# EAGLE design MySens-GWeasyRS485-Nano-V21-014 (EAGLE 7.6.0)
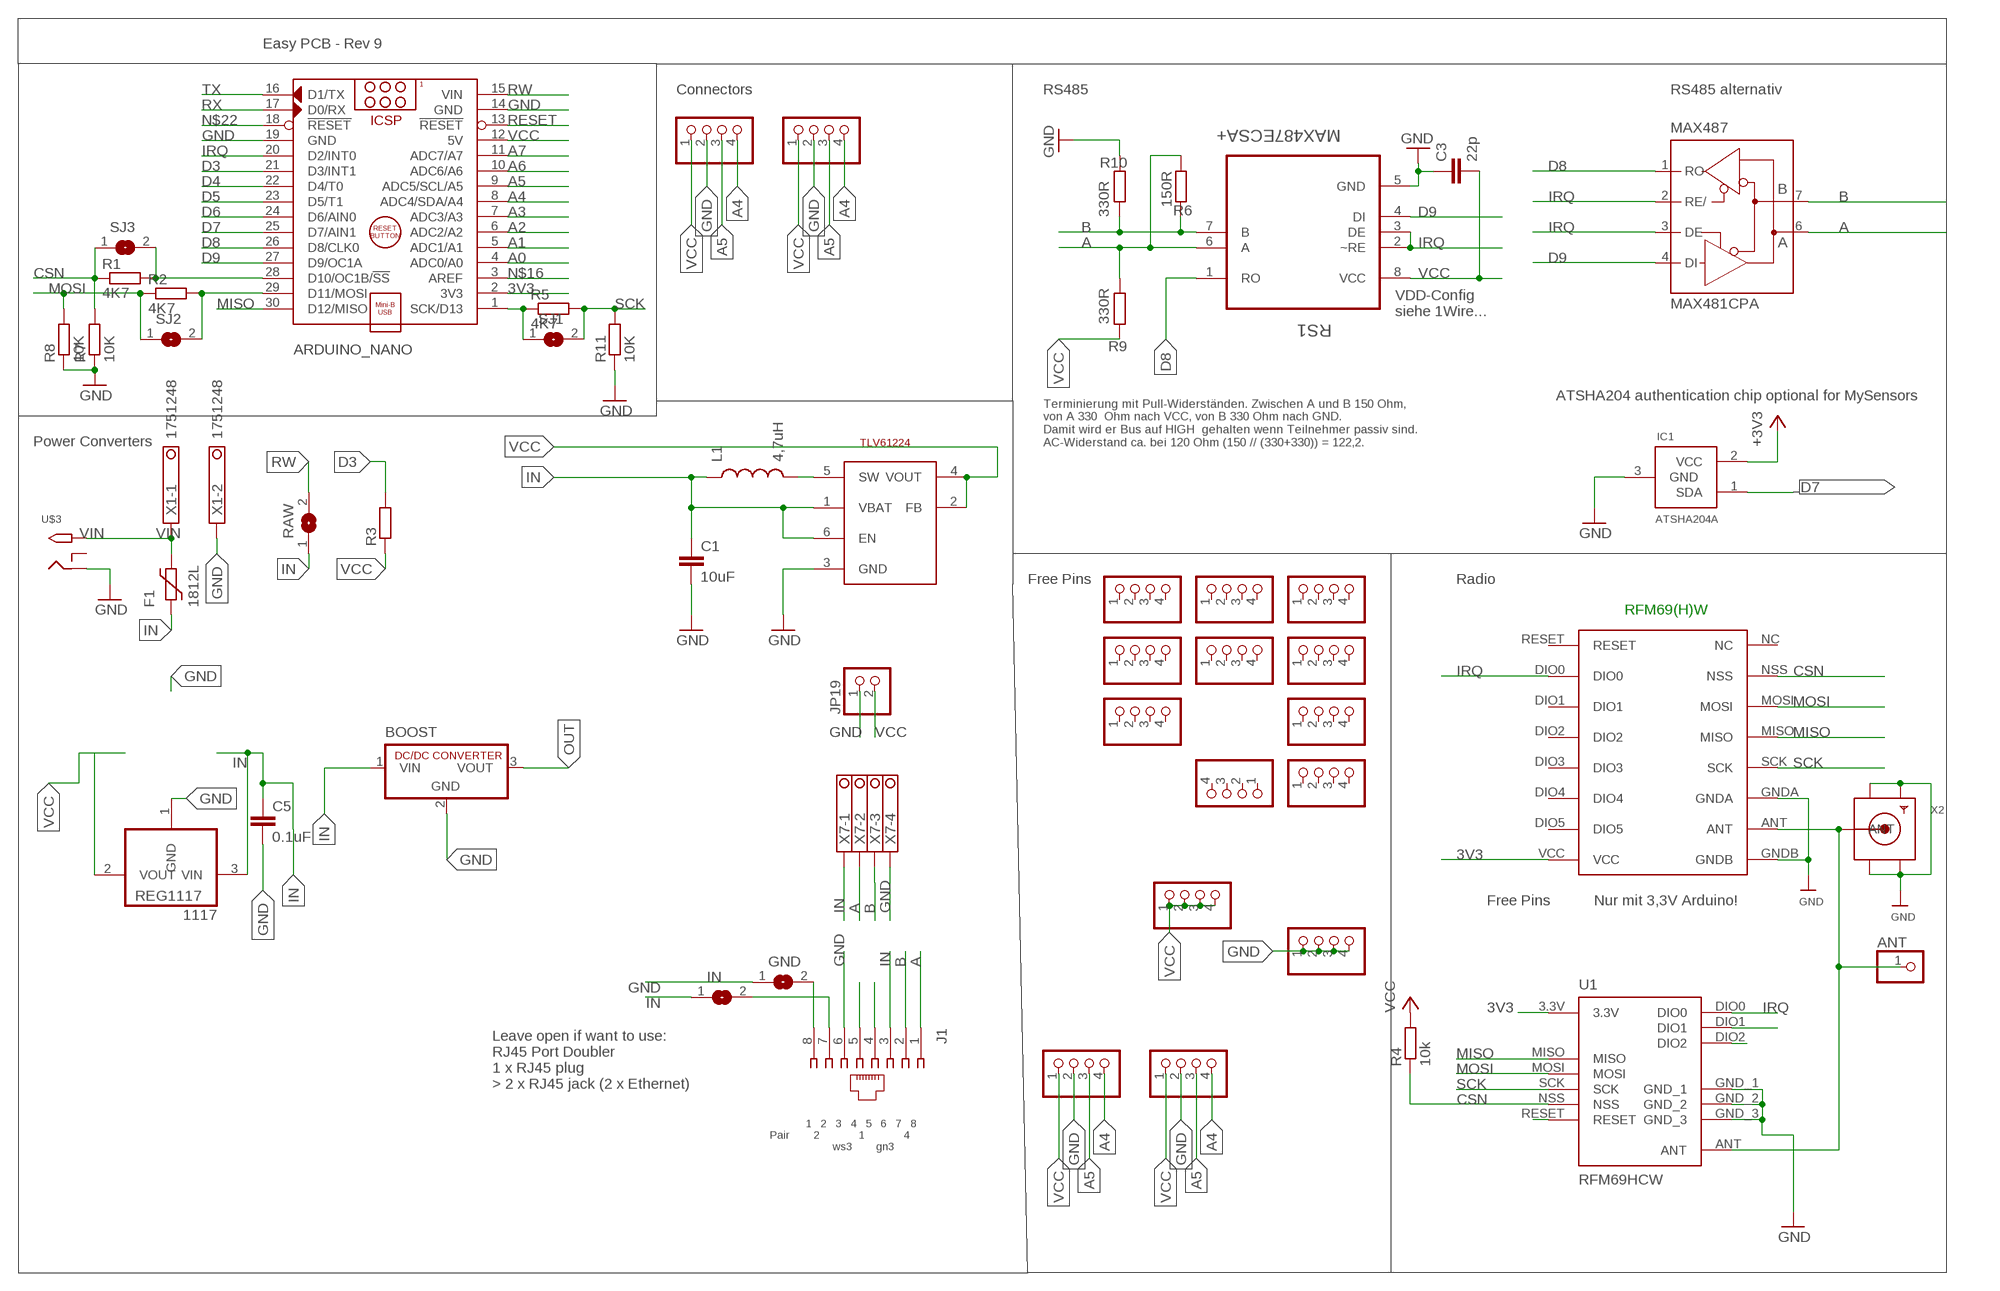
[diagram p0: schematic, sheet 1]

## Parts
1117  REG1117  [SOT223]
ANT  PINHD-1X1  [1X01]
ARDUINO_NANO  ARDUINO_NANO_OHNE-BOHR  [ARDUINO_NANO]
BOOST  R-78C1.8-1.0  [SIP3]
C1  10uF  CAP0805  [0805]
C3  22p  C-EUC0805  [C0805]
C5  0.1uF  C-EUC1206  [C1206]
F1  1812L  [1812L]
GND  SJ  [SJ]
IC1  ATSHA204A  [SOT23]
IN  SJ  [SJ]
J1  215878-2  [215878-2]
JP1  PINHD-1X04_2.54-S  [1X04-S]
JP2  PINHD-1X04_2.54-S  [1X04-S]
JP3  PINHD-1X04_2.54-S  [1X04-S]
JP4  PINHD-1X04_2.54-S  [1X04-S]
JP5  PINHD-1X04_2.54-S  [1X04-S]
JP6  PINHD-1X04_2.54-S  [1X04-S]
JP7  PINHD-1X04_2.54-S  [1X04-S]
JP8  PINHD-1X04_2.54-S  [1X04-S]
JP9  PINHD-1X04_2.54-S  [1X04-S]
JP10  PINHD-1X04_2.54-S  [1X04-S]
JP11  PINHD-1X04_2.54-S  [1X04-S]
JP12  PINHD-1X04_2.54-S  [1X04-S]
JP15  PINHD-1X04_2.54-S  [1X04-S]
JP16  PINHD-1X04_2.54-S  [1X04-S]
JP17  PINHD-1X04_2.54-S  [1X04-S]
JP18  PINHD-1X04_2.54-S  [1X04-S]
JP19  PINHD-1X2  [1X02]
L1  4,7uH  INDUCTOR0805  [0805]
MAX487  MAX481CPA  [DIL08]
R1  4K7  R-EU_M0805  [M0805]
R2  4K7  R-EU_M0805  [M0805]
R3  R-EU_R0805  [R0805]
R4  10k  R-EU_M0805  [M0805]
R5  4K7  R-EU_M0805  [M0805]
R6  150R  R-EU_R0805  [R0805]
R7  10K  R-EU_M0805  [M0805]
R8  10K  R-EU_M0805  [M0805]
R9  330R  R-EU_R0805  [R0805]
R10  330R  R-EU_R0805  [R0805]
R11  10K  R-EU_M0805  [M0805]
RAW  SJ  [SJ]
RFM69W  RFM69HW  [RFM]
RS1  MAX487ECSA+  [SOIC127P600X175-8N]
SJ1  SJ  [SJ]
SJ2  SJ  [SJ]
SJ3  SJ  [SJ]
STEPUP  TLV61224  TI-TLV61224  [SOT23-6L]
U1  RFM69HCW  [RFM69HCW-XXXS2]
U$3  2.1MMJACKTHM  [PJ-102A]
X1  1751248  [1751248]
X2  SMACONNECTOR_EDGE  [SMA_EDGELAUNCH]
X7  1751264  [1751264]

## Nets
3V3: ARDUINO_NANO.2(3V3) IC1.2(VCC) RFM69W.VCC U1.3.3V ; supply symbol labelled +3V3
A: J1.1 MAX487.6(A) R6.1 R9.2 RS1.6(A) X7.2
A0: ARDUINO_NANO.4(ADC0/A0)
A1: ARDUINO_NANO.5(ADC1/A1)
A2: ARDUINO_NANO.6(ADC2/A2)
A3: ARDUINO_NANO.7(ADC3/A3)
A4: ARDUINO_NANO.8(ADC4/SDA/A4) JP6.4 JP10.4 JP17.4 JP18.4
A5: ARDUINO_NANO.9(ADC5/SCL/A5) JP6.3 JP10.3 JP17.3 JP18.3
A6: ARDUINO_NANO.10(ADC6/A6)
A7: ARDUINO_NANO.11(ADC7/A7)
ANT: ANT.1 RFM69W.ANT U1.ANT X2.P(ANT)
B: J1.2 MAX487.7(B) R6.2 R10.1 RS1.7(B) X7.3
CSN: R1.1 R4.1 R7.2 RFM69W.NSS SJ3.1 U1.NSS
D3: ARDUINO_NANO.21(D3/INT1) R3.2
D4: ARDUINO_NANO.22(D4/T0)
D5: ARDUINO_NANO.23(D5/T1)
D6: ARDUINO_NANO.24(D6/AIN0)
D7: ARDUINO_NANO.25(D7/AIN1) IC1.1(SDA)
D8: ARDUINO_NANO.26(D8/CLK0) MAX487.1(RO) RS1.1(RO)
D9: ARDUINO_NANO.27(D9/OC1A) MAX487.4(DI) RS1.4(DI)
E7 [Power]: IN.2 J1.7
GND [Power]: 1117.1(GND) ARDUINO_NANO.14(GND) ARDUINO_NANO.19(GND) BOOST.2(GND) C1.2 C3.1 C5.2 GND.1 IC1.3(GND) J1.6 JP1.1 JP1.2 JP1.3 JP1.4 JP6.2 JP10.2 JP17.2 JP18.2 JP19.1 R7.1 R8.1 R10.2 R11.1 RFM69W.GNDA RFM69W.GNDB RS1.5(GND) STEPUP.3(GND) U1.GND_1 U1.GND_2 U1.GND_3 U$3.RING X1.2 X2.GND@1(GND4) X2.GND@2(GND3) X2.GND@3(GND2) X2.GND@4(GND1) X7.4
IN [Power]: 1117.3(VIN) BOOST.1(VIN) C1.1 C5.1 F1.P$1 IN.1 J1.3 L1.1 RAW.1 STEPUP.1(VBAT) STEPUP.6(EN) X7.1
IRQ: ARDUINO_NANO.20(D2/INT0) MAX487.2(RE/) MAX487.3(DE) RFM69W.DIO0 RS1.2(~RE) RS1.3(DE) U1.DIO0
MISO: ARDUINO_NANO.30(D12/MISO) RFM69W.MISO U1.MISO
MOSI: R2.1 R8.2 RFM69W.MOSI SJ2.1 U1.MOSI
N$1: U1.RESET
N$2: ARDUINO_NANO.1(SCK/D13) R5.1 SJ1.1
N$3: ARDUINO_NANO.28(D10/OC1B/!SS) R1.2 SJ3.2
N$4: ARDUINO_NANO.29(D11/MOSI) R2.2 SJ2.2
N$9: J1.4
N$10: J1.5
N$12: GND.2 J1.8
N$13: L1.2 STEPUP.5(SW)
N$14: U1.DIO2
N$15: U1.DIO1
N$16: ARDUINO_NANO.3(AREF)
N$22: ARDUINO_NANO.18(!RESET)
OUT [Power]: BOOST.3(VOUT)
RESET: ARDUINO_NANO.13(!RESET)
RW: ARDUINO_NANO.15(VIN) RAW.2
RX: ARDUINO_NANO.17(D0/RX)
SCK: R5.2 R11.2 RFM69W.SCK SJ1.2 U1.SCK
TX: ARDUINO_NANO.16(D1/TX)
VCC [Power]: 1117.2(VOUT) ARDUINO_NANO.12(5V) C3.2 JP3.1 JP3.2 JP3.3 JP3.4 JP6.1 JP10.1 JP17.1 JP18.1 JP19.2 R3.1 R4.2 R9.1 RS1.8(VCC) STEPUP.2(FB) STEPUP.4(VOUT)
VIN [Power]: F1.P$2 U$3.TIP X1.1
Unconnected: JP2.1 JP2.2 JP2.3 JP2.4 JP4.1 JP4.2 JP4.3 JP4.4 JP5.1 JP5.2 JP5.3 JP5.4 JP7.1 JP7.2 JP7.3 JP7.4 JP8.1 JP8.2 JP8.3 JP8.4 JP9.1 JP9.2 JP9.3 JP9.4 JP11.1 JP11.2 JP11.3 JP11.4 JP12.1 JP12.2 JP12.3 JP12.4 JP15.1 JP15.2 JP15.3 JP15.4 JP16.1 JP16.2 JP16.3 JP16.4 RFM69W.DIO1 RFM69W.DIO2 RFM69W.DIO3 RFM69W.DIO4 RFM69W.DIO5 RFM69W.NC RFM69W.RESET U$3.RING_SW

## Notes on the sheet
- Easy PCB - Rev 9
- Connectors | RS485 | RS485 alternativ
- VDD-Config
  siehe 1Wire...
- ATSHA204 authentication chip optional for MySensors
- Power Converters
- Terminierung mit Pull-Widerständen. Zwischen A und B 150 Ohm,
  von A 330  Ohm nach VCC, von B 330 Ohm nach GND. 
  Damit wird er Bus auf HIGH  gehalten wenn Teilnehmer passiv sind.
  AC-Widerstand ca. bei 120 Ohm (150 // (330+330)) = 122,2.
- Free Pins | Radio
- RFM69(H)W
- Free Pins | Nur mit 3,3V Arduino!
- Leave open if want to use:
  RJ45 Port Doubler
  1 x RJ45 plug 
  > 2 x RJ45 jack (2 x Ethernet)
- 1   2   3   4   5   6   7   8
  Pair        2             1             4
                       ws3        gn3

## Power pins joined to a net without a drawn wire
GND: MAX487.5(GND)
VCC: MAX487.8(VCC)

## Library data of the parts
1117 = burr-brown:REG1117: 800mA and 1A Low Dropout (LDO) Positive Regulator 1.8V, 2.5V, 2.85V, 3.3V, 5V, and Adj; MPN: REG1117; OC_FARNELL: 1097566; OC_NEWARK: 14P6981
ANT = pinhead:PINHD-1X1: PIN HEADER
ARDUINO_NANO = ArduinoNanoV30:ARDUINO_NANO_OHNE-BOHR: Arduino Nano V3.0 Module Overview: The Arduino Nano is a small, complete, and breadboard-friendly board based on the ATmega328 (Arduino Nano 3.x) or ATmega168 (Arduino Nano 2.x). It has more or less the same functionality of the Arduino Duemilanove, but in a different package. It lacks only a DC power jack, and works with a Mini-B USB cable instead of a standard one. The Nano was designed and is being produced by Gravitech <http://www.gravitech.us/arna30wiatp.html>. General specifications: Item Value Microcontroller Atmel ATmega168 or ATmega328 Operating Voltage (logic level) 5 V Input Voltage (recommended) 7-12 V Input Voltage (limits) 6-20 V Digital I/O Pins 14 (of which 6 provide PWM output) Analog Input Pins 8 DC Current per I/O Pin 40 mA Flash Memory 16 KB (ATmega168) or 32 KB (ATmega328) of which 2 KB used by bootloader SRAM 1 KB (ATmega168) or 2 KB (ATmega328) EEPROM 512 bytes (ATmega168) or 1 KB (ATmega328) Clock Speed 16 MHz Dimensions (Inches) 0.73" x 1.70" Dimensions (mm) 18mm x 45mm Overall height About 9 mm (not including pins) Weigth 5 g Power: The Arduino Nano can be powered via the Mini-B USB connection, 6-20V unregulated external power supply (pin 30), or 5V regulated external power supply (pin 27). The power source is automatically selected to the highest voltage source. Memory: The ATmega168 has 16 KB of flash memory for storing code (of which 2 KB is used for the bootloader); the ATmega328 has 32 KB, (also with 2 KB used for the bootloader). The ATmega168 has 1 KB of SRAM and 512 bytes of EEPROM (which can be read and written with the EEPROM library); the ATmega328 has 2 KB of SRAM and 1 KB of EEPROM. Input and Output: Each of the 14 digital pins on the Nano can be used as an input or output, using pinMode(), digitalWrite(), and digitalRead() functions. They operate at 5 volts. Each pin can provide or receive a maximum of 40 mA and has an internal pull-up resistor (disconnected by default) of 20-50 kOhms. In addition, some pins have specialized functions. Visit Arduino - ArduinoBoardNano <https://www.arduino.cc/en/Main/ArduinoBoardNano>
BOOST = dc-dc-converter:R-78C*-1.0: INNOLINE DC/DC-Converter 1.0 AMP SIP3 Single Output Source: Data sheet <http://www.mikrocontroller.net/attachment/150645/157764-da-01-en-DC_DC_WANDLER_R_78C5_0_1_0.pdf>
C1 = SparkFun-Passives:CAP: Capacitor Standard 0603 ceramic capacitor, and 0.1" leaded capacitor.
C3 C5 = rcl:C-EU: CAPACITOR, European symbol
F1 = ptc-littlefuse:1812L
GND IN RAW SJ1-SJ3 = jumper:SJ: SMD solder JUMPER
IC1 = Sensor:ATSHA204A
J1 = con-amp:215878-2: AMP connector
JP1-JP12 JP15-JP18 = pinhead-2:PINHD-1X04: PIN HEADER
JP19 = pinhead:PINHD-1X2: PIN HEADER
L1 = SparkFun-Passives:INDUCTOR: Inductors Basic Inductor/Choke - 0603 and 1206. Footprints are not proven and vary greatly between part numbers.
MAX487 = maxim-4:MAX481CPA: RS485 TRANSEIVER
R1-R11 = rcl:R-EU_: RESISTOR, European symbol
RFM69W = hoperf:RFM69HW
RS1 = Maxim_By_element14_Batch_1:MAX487ECSA+: Low-Power, Slew-Rate-Limited RS-485/RS-422 Transceivers; MPN: MAX487ECSA+; OC_FARNELL: 9724532; OC_NEWARK: 68K4803; PACKAGE: SOIC-8; SUPPLIER: Maxim
STEPUP = TLV61224:TI-TLV61224
U1 = doug:RFM69H
U$3 = adafruit:2.1MMJACK: 2.1mm x 5.5mm THM DC jack with internal switch. Digikey part #PJ-102A, 4UCON part #05537 2.1mm x 5.5mm SMT DC jack with internal switch. Digikey part #PJ-002A-SMT, 4UCON part #03267 By microbuilder.eu & adafruit.com
X1 = con-phoenix-350:1751248: MKDS 1/ 2-3,5 Printklemme Nennstrom: 10 A Bemessungsspannung: 160 V Raster: 3,5 mm Polzahl: 2 Montageart: Löten Anschlussart: Schraubanschluss Anschlussrichtung vom Leiter zur Platine: 0° Source: http://eshop.phoenixcontact.com .. 1751248.pdf; OC_FARNELL: unknown; OC_NEWARK: unknown
X2 = adafruit:SMACONNECTOR: SMA Connector 90° DIP SMA Connector, 50 Ohm (4UConnector: 07259)
X7 = con-phoenix-350:1751264: MKDS 1/ 4-3,5 Printklemme Nennstrom: 10 A Bemessungsspannung: 160 V Raster: 3,5 mm Polzahl: 4 Montageart: Löten Anschlussart: Schraubanschluss Anschlussrichtung vom Leiter zur Platine: 0° Source: http://eshop.phoenixcontact.com .. 1751264.pdf; MPN: 1751264; OC_FARNELL: unknown; OC_NEWARK: 10R0934

## Net classes
0 default: width 0.305 mm
1 Power: width 0.508 mm

## Board
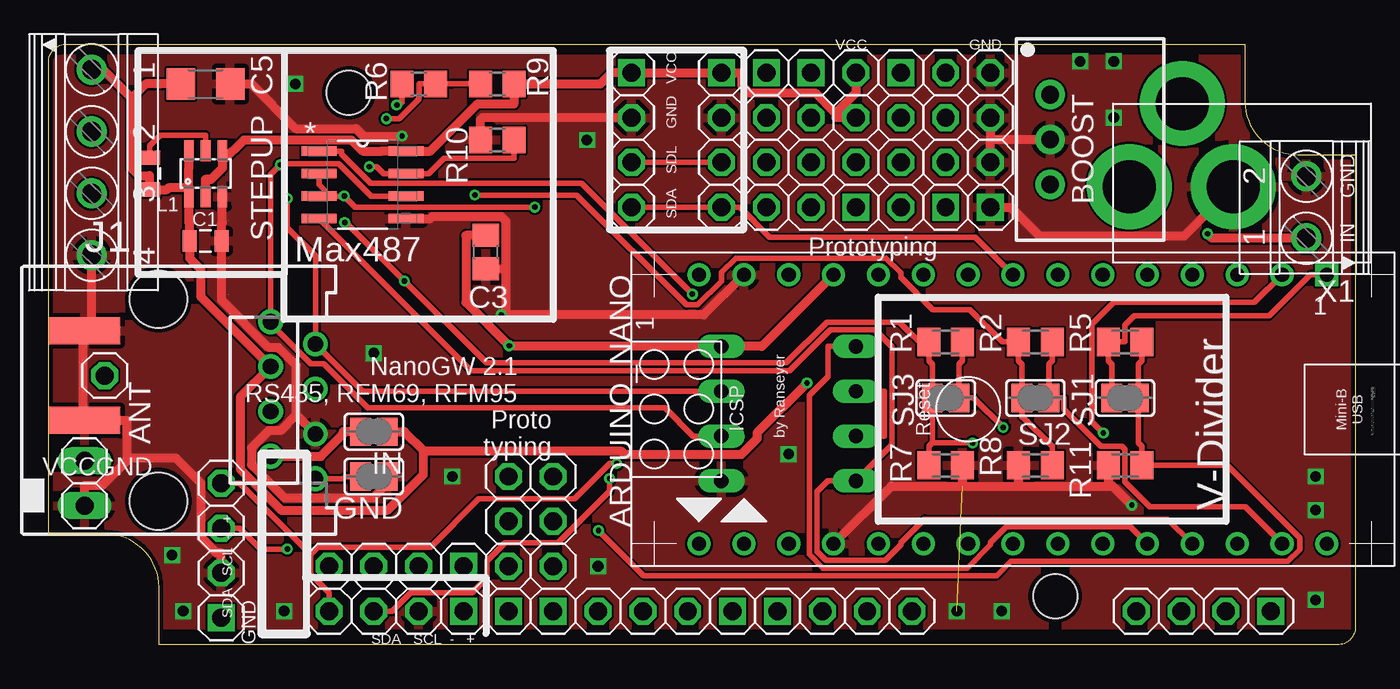
[diagram p1: board, top side]
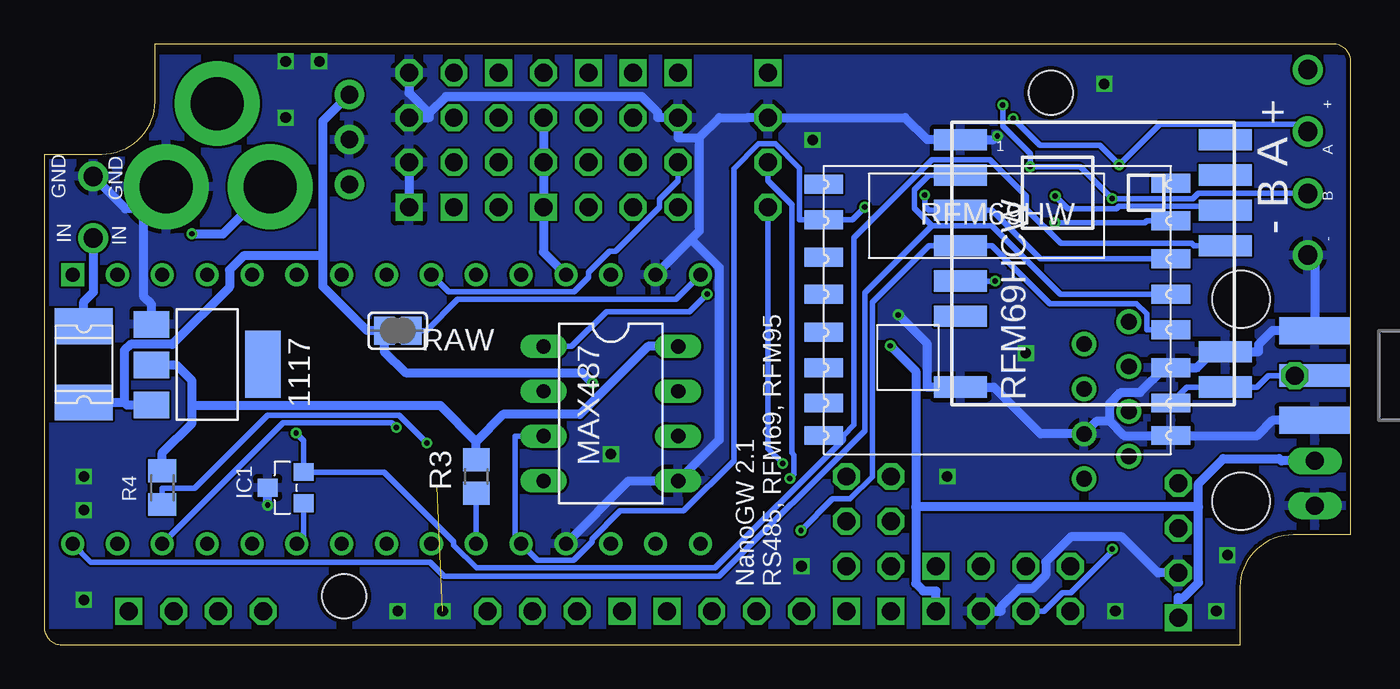
[diagram p2: board, bottom side, seen from below]

Size 74 x 34 mm. Coordinates in mm from the lower left corner, seen from the top.
Outline: 0,6.25 0,33 arc-90 1,34 67.75,34 67.75,30.75 arc90 70.75,27.75 74,27.75 74,1 arc-90 73,0 6.25,0 6.25,3.25 arc90 3.25,6.25 0,6.25
Copper layers (1*16): Top 0.035mm / dielectric 1.5mm / Bottom 0.035mm
Design rules "dirt_cheap_dirty_boards.v1": minimum track width 5mil, minimum drill 12mil, track to track 5mil, track to pad 5mil, pad to pad 5mil, via to via 5mil, smd to smd 0mil, copper to edge 10mil, drill to drill 10mil, minimum pad ring 10mil, minimum via ring 6mil, stop-mask expansion 2mil, vias tented up to drill 25mil, thermal gap 10mil
Holes 2.5 mm at 57,2.75 17,31.25
tRestrict: area 0.6,33.7 to 67.9,34.3; area 6.3,0 to 74.3,0.6
bRestrict: area 0.6,33.7 to 67.9,34.3; area 6.3,0 to 74.3,0.6

### Footprints (pad centres in the part's own frame; a part is rotated, then mirrored left to right if it is on the bottom)
SOT223 = smd 1.499 x 2.007: 1 -2.261,-3.15; 2 0.025,-3.15; 3 2.311,-3.15 | smd 3.81 x 2.007: 4 0,3.15
1X01 = drill 1.016 octagon: 1 0,0
ARDUINO_NANO = drill 0.8 square: 1 -20.32,-7.62 | drill 0.8: 2 -17.78,-7.62; 3 -15.24,-7.62; 4 -12.7,-7.62; 5 -10.16,-7.62; 6 -7.62,-7.62; 7 -5.08,-7.62; 8 -2.54,-7.62; 9 0,-7.62; 10 2.54,-7.62; 11 5.08,-7.62; 12 7.62,-7.62; 13 10.16,-7.62; 14 12.7,-7.62; 15 15.24,-7.62; 16 15.24,7.62; 17 12.7,7.62; 18 10.16,7.62; 19 7.62,7.62; 20 5.08,7.62; 21 2.54,7.62; 22 0,7.62; 23 -2.54,7.62; 24 -5.08,7.62; 25 -7.62,7.62; 26 -10.16,7.62; 27 -12.7,7.62; 28 -15.24,7.62; 29 -17.78,7.62; 30 -20.32,7.62
SIP3 = drill 1 pad 1.676: 1 -2.54,0; 2 0,0; 3 2.54,0
0805 = smd 0.8 x 1.2: 1 -0.9,0; 2 0.9,0
C0805 = smd 1.3 x 1.5: 1 -0.95,0; 2 0.95,0
C1206 = smd 1.6 x 1.8: 1 -1.4,0; 2 1.4,0
1812L = smd 2.03 x 3.3: P$1 -2.16,0; P$2 2.16,0
SJ = smd 1.168 x 1.6: 1 -0.762,0; 2 0.762,0
SOT23 = smd 1.016 x 1.143: 1 -0.889,-1.016; 2 0.889,-1.016; 3 0,1.016
215878-2 = drill 0.889: 1 -4.445,6.35; 2 -3.175,8.89; 3 -1.905,6.35; 4 -0.635,8.89; 5 0.635,6.35; 6 1.905,8.89; 7 3.175,6.35; 8 4.445,8.89 | hole 3.251: -5.715,0; 5.715,0
1X04-S = drill 1.016 square: 1 -3.81,0 | drill 1.016 octagon: 2 -1.27,0; 3 1.27,0; 4 3.81,0
1X02 = drill 1.016 long: 1 -1.27,0; 2 1.27,0
DIL08 = drill 0.813 long: 1 -3.81,-3.81; 2 -1.27,-3.81; 3 1.27,-3.81; 4 3.81,-3.81; 5 3.81,3.81; 6 1.27,3.81; 7 -1.27,3.81; 8 -3.81,3.81
M0805 = smd 1.3 x 1.6: 1 -0.95,0; 2 0.95,0
R0805 = smd 1.3 x 1.5: 1 -0.95,0; 2 0.95,0
RFM = smd 2.184 x 1.067: ANT 19.651,2.889; DIO0 0,13.27; DIO1 0,11.143; DIO2 0,9.047; DIO3 0,6.889; DIO4 0,4.889; DIO5 0,2.889; GNDA 19.651,4.889; GNDB 19.651,1.048; MISO 19.651,9.047; MOSI 19.651,11.047; NC 19.651,15.334; NSS 19.651,13.206; RESET 0,15.27; SCK 19.651,7.048; VCC 0,1.048
SOIC127P600X175-8N = smd 1.981 x 0.533: 1 -2.464,1.905; 2 -2.464,0.635; 3 -2.464,-0.635; 4 -2.464,-1.905; 5 2.464,-1.905; 6 2.464,-0.635; 7 2.464,0.635; 8 2.464,1.905
SOT23-6L = smd 0.55 x 1.2: 1 -0.95,-1.3; 2 0,-1.3; 3 0.95,-1.3; 4 0.95,1.3; 5 0,1.3; 6 -0.95,1.3
RFM69HCW-XXXS2 = smd 3 x 1.2: 3.3V 7.5,1; ANT 7.5,-7; DIO0 7.5,3; DIO1 7.5,5; DIO2 7.5,7; GND_1 7.5,-5; GND_2 -7.5,-7; GND_3 -7.5,7; MISO -7.5,5; MOSI -7.5,3; NSS -7.5,-1; RESET -7.5,-3; SCK -7.5,1
PJ-102A = drill 3 pad 4.8: RING 0.1,-3.39; RING_SW -4.6,-6.29; TIP 0.1,-9.29
1751248 = drill 1.1 pad 1.7: 1 -1.75,-0.1; 2 1.75,-0.1
SMA_EDGELAUNCH = smd 4.064 x 1.524: GND@1 2.032,-2.54; GND@2 2.032,2.54 | smd 4.064 x 1.524 bottom: GND@3 2.032,2.54; GND@4 2.032,-2.54 | smd 4.064 x 1.27: P 2.032,0
1751264 = drill 1.1 pad 1.7: 1 -5.25,-0.1; 2 -1.75,-0.1; 3 1.75,-0.1; 4 5.25,-0.1

### Placement (x,y rotation side)
1117  64.77,15.88 270 bottom
ANT  3.17,15.24 0 top
ARDUINO_NANO  52.07,13.34 180 top
BOOST  56.72,28.6 270 top
C1  8.89,22.86 0 top
C3  24.77,22.23 90 top
C5  8.89,31.75 0 top
F1  71.75,15.88 90 bottom
GND  18.41,9.53 180 top
IC1  60.33,8.89 90 bottom
IN  18.41,12.06 180 top
J1  6.22,13.84 270 top
JP1  53.34,28.57 90 top
JP2  45.09,1.91 0 top
JP3  45.72,28.57 90 top
JP4  65.41,1.91 180 top
JP5  28.57,5.71 90 top
JP6  33.02,28.57 270 top
JP7  19.68,4.45 180 top
JP8  26.04,5.71 90 top
JP9  34.92,1.91 180 top
JP10  38.1,28.57 270 top
JP11  50.8,28.57 90 top
JP12  43.18,28.57 270 top
JP15  40.64,28.57 270 top
JP16  48.26,28.57 270 top
JP17  9.78,5.33 90 top
JP18  19.68,1.91 180 top
JP19  2.03,9.14 90 top
L1  5.71,26.67 90 top
MAX487  41.91,13.08 270 bottom
R1  50.8,17.14 0 top
R2  55.88,17.14 0 top
R3  49.53,9.53 270 bottom
R4  67.31,8.89 90 bottom
R5  60.96,17.14 0 top
R6  20.95,31.75 180 top
R7  50.8,10.16 180 top
R8  55.88,10.16 0 top
R9  25.4,31.75 180 top
R10  25.4,28.57 180 top
R11  60.96,10.16 0 top
RAW  53.98,17.78 0 bottom
RFM69W  29.84,10.79 0 bottom
RS1  17.78,26.04 0 top
SJ1  60.96,13.97 0 top
SJ2  55.88,13.97 0 top
SJ3  50.8,13.97 0 top
STEPUP  8.89,26.67 0 top
U1  14.61,21.59 0 bottom
U$3  70.48,26.04 270 top
X1  71.12,24.77 90 top
X2  0,15.24 180 bottom
X7  2.54,27.3 270 top

### Tracks (layer width: path | path; a pad name or v marks a point on that pad's centre or on a via)
3V3  (via drill 0.3 pad 0.61)
  Top 0.305: v59.73,11.98 59.08,12.63 59.08,18.14 60.33,19.38 68.28,19.38 ARDUINO_NANO.2
  Bottom 0.305: 28.74,11.84 28.74,11.61 36.01,4.35 49.52,4.35 50.8,5.63 50.8,5.82 54.76,9.78 IC1.2 59.31,11.56 v59.73,11.98 | 28.74,11.84 28.14,12.44 28.14,23.05 23.72,27.47 20.44,27.47 18.37,25.4 18.37,24.66 16.43,22.72 9.01,22.72 8.88,22.59 U1.3.3V | RFM69W.VCC 28.74,11.84
A  (via drill 0.3 pad 0.61)
  Top 0.305: v19.12,29.78 19.84,29.78 20.98,30.92 20.98,31.75 R6.1 22.83,31.75 R9.2 | MAX487.6 36.5,11.81 34.9,13.41 18.05,13.41 15.56,15.9 14.85,15.9 12.57,18.18 J1.1 12.57,26.63 v13.12,27.17 13.19,27.24 16.43,27.24 18.27,25.4 RS1.6
  Bottom 0.305: v19.12,29.78 17.61,28.27 14.21,28.27 v13.12,27.17 10.82,29.47 2.85,29.47 X7.2
A4  (via drill 0.3 pad 0.61)
  Top 0.305: v32.17,10.26 31.79,10.26 29.79,8.26 24.34,8.26 21.62,5.53 15.23,5.53 14.83,5.13 | 14.83,5.13 10.82,9.14 JP17.4 | 14.83,5.13 14.83,3.99 15.88,2.95 JP18.4 | ARDUINO_NANO.8 52.49,23.08 40.83,23.08 39.14,24.77 JP10.4 JP6.4
  Bottom 0.305: v32.17,10.26 33.02,11.11 JP6.4
A5  (via drill 0.3 pad 0.61)
  Top 0.305: JP18.3 19.46,1.91 20.5,2.95 23.98,2.95 24.84,3.8 24.84,4.76 25.85,5.77 28.85,5.77 31.77,8.69 v31.77,9.41 | JP17.3 10.82,6.6 12.01,5.42 v13.51,5.42 | JP6.3 JP10.3
  Bottom 0.305: JP6.3 33.02,26.26 31.66,24.9 31.66,10.86 31.54,10.74 31.54,9.64 v31.77,9.41 | JP10.3 38.1,26.26 39.14,25.22 39.14,24.78 41.64,22.29 41.97,22.29 43.18,21.08 43.18,20.81 44.01,19.99 51.1,19.99 ARDUINO_NANO.9 | JP18.3 17.37,1.91 16.33,2.95 15.85,2.95 13.51,5.28 v13.51,5.42
ANT  (1 unrouted)
  Bottom 0.305: RFM69W.ANT 9.29,14.59 U1.ANT 5.33,14.59 4.68,15.24 ANT.1 X2.P
B  (via drill 0.3 pad 0.61)
  Top 0.305: v19.71,30.55 19.88,30.72 20,30.72 R6.2 | v13.52,25.26 13.52,23.61 15.11,22.02 J1.2 17.78,14.35 36.5,14.35 MAX487.7 | v18.16,27.06 18.59,27.06 18.97,26.67 RS1.7 21.51,26.67 22.39,27.55 26.35,27.55 R10.1 | v18.16,27.06
  Bottom 0.305: v19.71,30.55 19.71,29.35 18.16,27.79 v18.16,27.06 15.32,27.06 v13.52,25.26 8.94,25.26 8.64,25.55 X7.3
CSN  (via drill 0.3 pad 0.61)  (1 unrouted)
  Top 0.305: 49.85,16.61 48.19,18.27 44.07,18.27 41.75,15.95 24.79,15.95 v20.15,20.59 16.84,23.9 v16.77,23.9 | 50.04,11.43 v52.33,11.43 | 50.04,11.43 49.85,11.24 R7.2 | 50.04,11.43 SJ3.1 50.04,15.88 49.85,16.07 49.85,16.61 | R1.1 49.85,16.61
  Bottom 0.305: v52.33,11.43 53.9,13 61.35,13 65.48,8.87 67.31,8.87 R4.1 | RFM69W.NSS 11.56,24 11.67,23.9 v16.77,23.9 | U1.NSS v20.15,20.59
D3
  Bottom 0.305: R3.2 ARDUINO_NANO.21
D7
  Bottom 0.305: IC1.1 59.31,6.1 ARDUINO_NANO.25
D8  (via drill 0.3 pad 0.61)
  Top 0.305: ARDUINO_NANO.26 61.26,6.68 54.24,6.68 53.34,5.78 53.34,5.66 52.03,4.34 43.85,4.34 43.08,5.12 43.08,14.13 44.12,15.17 44.12,16.89 MAX487.1 | v36.46,19.85 30.18,26.12 18.24,26.12 16.59,27.78 16.59,27.94 RS1.1
  Bottom 0.305: v36.46,19.85 37.45,18.86 42.15,18.86 44.12,16.89 MAX487.1
D9
  Top 0.305: ARDUINO_NANO.27 63.37,7.12 49.6,7.12 48.26,5.78 48.26,5.65 47.38,4.78 44.03,4.78 43.51,5.3 43.51,8.66 44.12,9.27 MAX487.4 47.77,11.32 47.77,16.86 46.79,17.84 44.28,17.84 41.96,15.52 23.93,15.52 RS1.4
E7
  Top 0.508: IN.2 16.69,12.06 16.69,11.94 15.41,10.67 J1.7
GND  (via drill 0.3 pad 0.61, 0.6)  (1 unrouted)
  Top 0.508: 25.9,18.68 v25.63,18.68 | ARDUINO_NANO.14 37.09,18.68 25.9,18.68 | 25.9,18.68 25.9,21.27 | R10.2 24.45,29.71 24.59,29.84 JP6.2 | 54.93,8.98 60.01,8.98 | 51.75,8.98 54.93,8.98 | 60.01,8.98 60.26,8.98 v61.34,7.9 | 25.9,21.27 25.9,23.98 25.65,24.23 21.72,24.23 21.62,24.13 RS1.5 | v20.02,28.8 17.82,28.8 17.4,29.22 14,29.22 11.47,31.75 C5.2 | R7.1 51.75,8.98 | ARDUINO_NANO.19 47.71,8.98 51.75,8.98 | C3.1 25.9,21.27 | R8.1 54.93,8.98 | 60.01,8.98 60.01,9.14 R11.1 | 14.03,13.02 14.03,15.82 13.02,16.83 12.47,16.83 9.79,19.51 C1.2 9.79,23.84 9.84,23.89 STEPUP.3 | J1.6 14.03,13.02 | 14.03,13.02 13.13,12.13 12.47,12.13 11.49,11.15 11.49,10.2 13.38,8.32 18.37,8.32 19.18,9.13 GND.1 | 53.47,28.57 53.34,28.45 JP1.2 | BOOST.2 53.49,28.6 53.47,28.57 | 53.47,28.57 53.34,28.7 JP1.3 | JP1.1 54.48,24.77 56.09,23.15 64.31,23.15 U$3.RING | 4.45,10.55 4.45,12.7 X2.GND@2 1.97,12.76 1.97,17.72 X2.GND@1 2.44,18.19 X7.4 | 4.45,10.55 4.45,10.42 3.04,9.02 2.03,9.02 JP19.1 | 4.45,10.55 7.24,10.55 8.64,9.15 8.64,6.06 9.49,5.21 9.78,5.21 JP17.2
  Bottom 0.508: 37.37,22.96 ARDUINO_NANO.14 | 36.9,28.7 36.9,23.42 37.37,22.96 | 37.37,22.96 35.77,21.36 35.77,11.6 MAX487.5 40.89,9.27 ARDUINO_NANO.19 | 36.9,28.7 35.76,29.84 34.16,29.84 JP6.2 25.24,29.84 23.99,28.59 U1.GND_3 20.22,28.59 v20.02,28.8 | 36.9,28.7 38.1,28.7 JP10.2 39.24,29.84 39.24,30.13 40.15,31.04 51.24,31.04 52.19,30.09 | v25.63,18.68 23.99,17.04 23.99,14.59 U1.GND_2 20.22,14.59 17.57,11.94 J1.6 14.4,12.65 13.65,12.65 | v61.34,7.9 IC1.3 | JP1.2 JP1.1 | JP18.2 19.81,1.91 19.81,2.14 18.78,3.17 18.04,3.17 17.27,3.95 17.27,4.7 15.87,6.11 12.96,6.11 10.92,4.06 JP17.2 | 52.19,30.09 52.2,30.08 52.2,29.84 JP1.3 | 52.19,30.09 53.34,31.24 JP1.4 | 68.35,24.68 U$3.RING | 68.35,24.68 68.35,19.7 67.92,19.27 1117.1 | 68.35,24.68 69.38,24.68 X1.2 | X2.GND@2 4.45,12.7 5.3,11.84 RFM69W.GNDB 12.85,11.84 13.65,12.65 | X7.4 2.03,21.65 X2.GND@1 4.45,17.78 5.22,17 5.22,16.59 6.17,16.59 U1.GND_1 7.81,16.59 8.72,15.68 RFM69W.GNDA 10.54,15.68 11.94,14.29 13.02,14.29 13.65,13.65 13.65,12.65
  other vias: 13.97,31.75 30.48,28.57 7.62,1.91 6.99,5.08 13.34,1.91 31.11,4.45 51.44,1.91 53.98,1.91 71.75,2.54 71.75,9.53 71.75,7.62 60.33,33.02 58.42,33.02 60.33,29.84 41.91,10.79 22.86,9.53 18.41,16.51
  pour Top: 0,34.29 73.66,34.29 73.66,0 0,0
  pour Bottom: 73.66,0 73.66,34.29 0,34.29 0,0
IN  (via drill 0.3 pad 0.61)
  Top 0.508: 21.22,10.95 21.22,10.99 20.14,12.06 IN.1 | 21.22,10.95 21.22,9.64 19.21,7.63 13.17,7.63 10.86,9.94 10.86,14.03 J1.3 8.61,19.71 8.61,21.26 7.99,21.88 C1.1 7.99,23.84 7.94,23.89 STEPUP.1 7.94,25.61 7.94,25.86 | v42.94,14.82 40.12,11.99 40.12,11.68 39.21,10.77 32.64,10.77 32.46,10.95 21.22,10.95 | 4.7,30.94 4.7,26.98 5.13,26.55 5.71,26.55 L1.1 6.7,25.77 6.79,25.86 7.94,25.86 | 4.7,30.94 5.5,31.75 6.31,31.75 C5.1 | X7.1 3.08,32.55 4.7,30.94 | 7.94,25.86 7.94,26.99 STEPUP.6
  Bottom 0.508: v42.94,14.82 43.53,15.4 53.54,15.4 54.74,16.6 RAW.1 55.7,17.78 58.2,20.28 58.2,22.02 | 58.2,22.02 58.2,29.66 BOOST.1 | 58.2,22.02 62.7,22.02 63.5,21.22 63.5,20.25 66.74,17 69.11,17 69.45,16.66 69.45,13.71 | 69.45,13.71 69.3,13.56 1117.3 | F1.P$1 69.45,13.71
IRQ  (via drill 0.3 pad 0.61)
  Top 0.305: 15.95,25.4 15.32,26.04 RS1.2 | 15.95,25.4 16.59,25.4 v16.74,25.4 17.37,24.77 v27.53,24.77 | RS1.3 15.95,25.4 | MAX487.2 47.32,14.35 47.32,11.81 MAX487.3
  Bottom 0.305: v27.53,24.77 28.24,24.07 28.47,24.07 RFM69W.DIO0 31.22,24.07 31.22,26.98 32.6,28.36 33.55,28.36 34.95,26.95 34.95,10.42 37.78,7.59 41.38,7.59 42.98,5.98 42.98,5.83 44.03,4.78 46.05,4.78 ARDUINO_NANO.20 47.32,6.04 47.32,11.81 MAX487.3 | U1.DIO0 7.33,24.81 13.14,24.81 13.28,24.67 16.02,24.67 v16.74,25.4
MISO  (1 unrouted)
  Bottom 0.305: 23.74,23.71 20.32,23.71 16.46,19.84 RFM69W.MISO | 23.74,23.71 24.73,24.7 24.73,25.75 23.88,26.59 U1.MISO | 23.74,23.71 27.53,19.92 27.53,12.13 35.77,3.88 51.34,3.88 52.13,4.67 71.35,4.67 ARDUINO_NANO.30
MOSI  (via drill 0.3 pad 0.61)  (1 unrouted)
  Top 0.305: R8.2 56.83,11.24 55.18,12.89 55.12,12.89 SJ2.1 55.12,15.88 54.93,16.07 R2.1 54,17.14 52.17,18.97 50.08,18.97 48.26,20.79 48.26,21.05 47.42,21.89 38.92,21.89 38.1,21.08 38.1,20.59 36.75,19.24 36.11,19.24 29.89,25.46 v24.13,25.46
  Bottom 0.305: RFM69W.MOSI 17.58,21.84 20.33,24.59 21.31,24.59 U1.MOSI 23.88,24.59 24.13,24.84 v24.13,25.46
N$2
  Top 0.305: SJ1.1 60.2,15.88 60.01,16.07 R5.1 60.94,17.14 60.94,18.07 61.48,18.62 69.12,18.62 71.46,20.95 ARDUINO_NANO.1
N$3  (via drill 0.3 pad 0.61)
  Top 0.305: v54.06,12.3 52.43,13.94 52.43,13.97 SJ3.2 51.56,15.88 51.75,16.07 R1.2
  Bottom 0.305: ARDUINO_NANO.28 60.46,12.57 54.32,12.57 v54.06,12.3
N$4
  Top 0.305: ARDUINO_NANO.29 67.76,7.81 62.35,7.81 60.94,9.22 60.94,11.08 60.78,11.24 59.59,11.24 57.51,13.32 57.51,13.97 SJ2.2 56.64,15.88 56.83,16.07 R2.2
N$12
  Top 0.305: GND.2 16.79,9.53 16.66,9.4 J1.8
N$13
  Top 0.305: L1.2 5.71,28.25 6.32,28.85 8.89,28.85 STEPUP.5
RW
  Bottom 0.305: ARDUINO_NANO.15 38.23,19.56 50.57,19.56 52.35,17.78 RAW.2
SCK  (via drill 0.3 pad 0.61)  (1 unrouted)
  Top 0.305: v31.14,6.46 33.69,3.91 53.7,3.91 54.51,4.72 70.18,4.72 70.84,5.38 70.84,6.06 66.74,10.16 R11.2 61.91,11.24 61.72,11.43 SJ1.2 61.72,15.88 61.91,16.07 R5.2
  Bottom 0.305: v31.14,6.46 29.35,8.26 28.37,8.26 27.1,9.52 27.1,19.38 23.88,22.59 U1.SCK 21.21,22.59 20.33,22.59 17.04,19.3 12.14,19.3 11.56,18.73 11.56,17.84 RFM69W.SCK
VCC  (via drill 0.3 pad 0.61)
  Top 0.508: 9.84,27.37 11.06,28.59 17.14,28.59 17.79,27.94 18.87,27.94 20.22,27.94 RS1.8 21.62,27.94 24.29,30.62 26.35,30.62 R9.1 31.24,31.75 31.88,32.38 JP6.1 JP10.1 39.24,32.38 39.24,31.67 39.67,31.24 43.42,31.24 44.57,30.09 | ARDUINO_NANO.12 40.39,16.89 MAX487.8 26.12,16.89 v26.08,16.93 23.63,19.38 23.63,23.18 C3.2 | 44.57,30.09 44.58,30.08 44.58,29.84 JP3.3 | 44.57,30.09 45.72,31.24 JP3.4 | 9.84,27.37 9.84,27.36 9.84,26.99 9.2,26.35 8.89,26.35 STEPUP.2 | STEPUP.4 9.84,27.37
  Bottom 0.508: ARDUINO_NANO.12 45.72,22.23 JP3.1 JP3.2 JP3.3 | 65.63,13.55 51.57,13.55 49.53,11.51 | 65.63,13.55 65.63,14.94 66.53,15.85 1117.2 | 65.63,13.55 65.63,12.55 67.31,10.87 R4.2 | R3.1 49.53,11.51 | MAX487.8 39.8,16.89 43.65,13.04 48,13.04 49.53,11.51 | v26.08,16.93 24.64,15.48 24.64,7.81 | 8.64,7.81 8.64,9.13 7.22,10.54 4.06,10.54 3.94,10.41 JP19.2 | 8.64,7.81 8.64,3.52 9.49,2.67 9.78,2.67 JP17.1 | 8.64,7.81 24.64,7.81 | 24.64,7.81 24.64,3.48 24.21,3.05 23.5,3.05 JP18.1
VIN  (via drill 0.3 pad 0.61)
  Top 0.508: X1.1 65.88,23.02 v65.63,23.27
  Bottom 0.508: v65.63,23.27 63.86,23.27 U$3.TIP | F1.P$2 71.75,19.43 71.22,19.97 X1.1

### Text on the board
tPlace: by Ranseyer
tNames: VCC | GND | VCC | GND | GND | SDL | SDA | IN | Max487 | Prototyping | NanoGW 2.1 / RS485, RFM69, RFM95 | Proto / typing | VCC | GND | V-Divider | GND | SDA SCL - + | SDA SCL - +
bNames: GND | GND | IN | - B A + | - B A + | IN | RFM69HCW | NanoGW 2.1 / RS485, RFM69, RFM95
Document: Case: Hammond 1551K